# Altium schematic sheet RP_ComputeModule3_rev.3.0.SchDoc
size A4
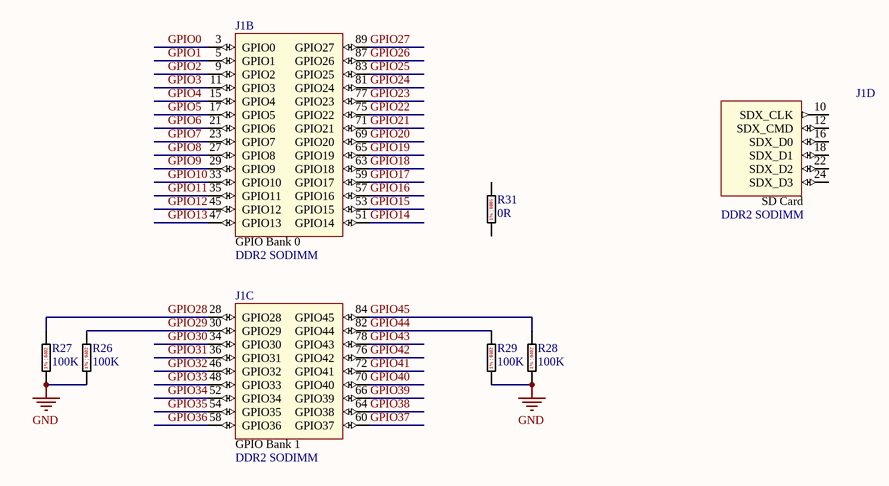
[diagram p0: RP_ComputeModule3_rev.3.0.SchDoc]

## Parts
J1  DDR2 SODIMM  [TE 1473005-4 (DDR2 SO-DIMM)]  (parts B,C,D of 14)
R26  100K  [RES0402]
R27  100K  [RES0402]
R28  100K  [RES0402]
R29  100K  [RES0402]
R31  0R  [YAGEO RES0402]

## Nets
GND: R26.2 R27.2 R28.2 R29.2
GPIO0: J1.3(GPIO0)
GPIO1: J1.5(GPIO1)
GPIO2: J1.9(GPIO2)
GPIO3: J1.11(GPIO3)
GPIO4: J1.15(GPIO4)
GPIO5: J1.17(GPIO5)
GPIO6: J1.21(GPIO6)
GPIO7: J1.23(GPIO7)
GPIO8: J1.27(GPIO8)
GPIO9: J1.29(GPIO9)
GPIO10: J1.33(GPIO10)
GPIO11: J1.35(GPIO11)
GPIO12: J1.45(GPIO12)
GPIO13: J1.47(GPIO13)
GPIO14: J1.51(GPIO14)
GPIO15: J1.53(GPIO15)
GPIO16: J1.57(GPIO16)
GPIO17: J1.59(GPIO17)
GPIO18: J1.63(GPIO18)
GPIO19: J1.65(GPIO19)
GPIO20: J1.69(GPIO20)
GPIO21: J1.71(GPIO21)
GPIO22: J1.75(GPIO22)
GPIO23: J1.77(GPIO23)
GPIO24: J1.81(GPIO24)
GPIO25: J1.83(GPIO25)
GPIO26: J1.87(GPIO26)
GPIO27: J1.89(GPIO27)
GPIO28: J1.28(GPIO28) R27.1
GPIO29: J1.30(GPIO29) R26.1
GPIO30: J1.34(GPIO30)
GPIO31: J1.36(GPIO31)
GPIO32: J1.46(GPIO32)
GPIO33: J1.48(GPIO33)
GPIO34: J1.52(GPIO34)
GPIO35: J1.54(GPIO35)
GPIO36: J1.58(GPIO36)
GPIO37: J1.60(GPIO37)
GPIO38: J1.64(GPIO38)
GPIO39: J1.66(GPIO39)
GPIO40: J1.70(GPIO40)
GPIO41: J1.72(GPIO41)
GPIO42: J1.76(GPIO42)
GPIO43: J1.78(GPIO43)
GPIO44: J1.82(GPIO44) R29.1
GPIO45: J1.84(GPIO45) R28.1

Not connected (* = marked no-connect by the designer): J1 10(SDX_CLK) 12(SDX_CMD) 16(SDX_D0) 18(SDX_D1) 22(SDX_D2) 24(SDX_D3); R31 1 2

## Notes on the sheet
- (in symbol 1473005-4, part B) GPIO Bank 0
- (in symbol 1473005-4, part C) GPIO Bank 1
- (in symbol 1473005-4, part D) SD Card
- (in symbol AC0805FR-070RL) 1% | 0805
- (in symbol SG73P1ETTP1003F) 1% | 0402

## Library data of the parts
J1 = 1473005-4: TE CONNECTIVITY / AMP         1473005-4             SOCKET IC, DIMM, DDR2, 1.8V, 200WAY; Number of Contacts: 200; Memory Type: SDRAM,DDR; Insulation Resistance: 250MR; PCB Mount Retention: With; Gender: Female; Contact Current Rating: 500mA; Circuit Application: Power; Connector System: Cable-to-Board; Sealable: No (Without); Pitch: 0.6mm; Row Spacing: 0.244inch; Stack Height: 5.2mm; Supplier 1: Digi-Key; Manufacturer: TE Connectivity; Manufacturer Part Number: 1473005-4; Stock 1: 3804; Pricing 1: 1=3.9, 10=3.744, 25=3.432, 50=3.276, 100=3.12, 250=2.73, 500=2.652, 1000=2.262, 2500=2.106 (USD); Mount: Surface Mount; Number of Pins: 200; Contact Material: Copper Alloy; Contact Plating: Gold; Housing Colour: Black; Housing Material: Thermoplastic; Insulation Material: Thermoplastic; Min Operating Temperature: -67°C; Max Operating Temperature: 185°C; Number of Rows: 2; Orientation: Right Angle; Termination: Solder; Packaging: Tray; Package Quantity: 20; Number of Positions: 200; Voltage Rating: 1.8V; Connector Type: Socket; Length: 71.5mm; Depth: 26mm; Radiation Hardening: No; ELV: Compliant; Flammability Rating: UL94 V-0; Lead Free: Lead Free; REACH SVHC: No SVHC; ComponentLink1URL: https://datasheet.ciiva.com/682/eng-cd-1473005-j2-682720.pdf; ComponentLink1Description: https://datasheet.ciiva.com/682/eng-cd-1473005-j2-682720.pdf; ComponentLink2URL: https://datasheet.ciiva.com/15171/getdatasheetpartid-99150-15171488.pdf; ComponentLink2Description: https://datasheet.ciiva.com/15171/getdatasheetpartid-99150-15171488.pdf; ComponentLink3URL: https://datasheet.ciiva.com/1105/582309-1105221.pdf; ComponentLink3Description: https://datasheet.ciiva.com/1105/582309-1105221.pdf; ComponentLink4URL: https://datasheet.ciiva.com/682/eng-cd-1473005-j2-682726.pdf; ComponentLink4Description: https://datasheet.ciiva.com/682/eng-cd-1473005-j2-682726.pdf; ComponentLink5URL: https://datasheet.ciiva.com/14156/04821302-14156311.pdf; ComponentLink5Description: https://datasheet.ciiva.com/14156/04821302-14156311.pdf; ComponentLink6URL: https://datasheet.ciiva.com/3136/eng-cd-1473005-j-3136060.pdf; ComponentLink6Description: https://datasheet.ciiva.com/3136/eng-cd-1473005-j-3136060.pdf; ComponentLink7URL: https://datasheet.ciiva.com/16380/eng-cd-1473005-j-16380909.pdf; ComponentLink7Description: https://datasheet.ciiva.com/16380/eng-cd-1473005-j-16380909.pdf; ComponentLink8URL: https://datasheet.ciiva.com/16651/eng-cd-1473005-j-16651646.pdf; ComponentLink8Description: https://datasheet.ciiva.com/16651/eng-cd-1473005-j-16651646.pdf
R26-R29 = SG73P1ETTP1003F: Thick Film Resistors - SMD 0.125W 100Kohm 1% 200ppm; Manufacturer: KOA Speer; Resistance: 100kR; Power Rating: 125mW; Voltage Rating: 200V; Temperature Coefficient: 200ppm/°C; Voltage Rating (DC): 50V; Supplier 1: Mouser; Manufacturer Part Number: SG73P1ETTP1003F; Stock 1: 17094; Pricing 1: 1=0.24, 10=0.24, 50=0.053, 100=0.041, 1000=0.03, 10000=0.018 (USD); Case/Package: 0402; Case Code (Imperial): 0402; Case Code (Metric): 1005; Min Operating Temperature: -55°C; Max Operating Temperature: 155°C; Tolerance: 1%; Packaging: Tape and Reel; Termination: SMD/SMT; ComponentLink1URL: https://datasheet.ciiva.com/5567/sg73-5567782.pdf; ComponentLink1Description: https://datasheet.ciiva.com/5567/sg73-5567782.pdf
R31 = AC0805FR-070RL: Thick Film Resistors - SMD 1/8W 0.0ohm 1%; Manufacturer: Yageo; Voltage Rating: 150V; Power Rating: 125mW; Resistance: 0mR; Temperature Coefficient: 200ppm/°C; Supplier 1: Mouser; Manufacturer Part Number: AC0805FR-070RL; Stock 1: 1027; Pricing 1: 1=0.16, 10=0.036, 50=0.036, 100=0.012, 1000=0.009, 10000=0.004 (USD); Mount: Surface Mount; Case/Package: 0805; Case Code (Imperial): 0805; Case Code (Metric): 2012; Min Operating Temperature: -55°C; Max Operating Temperature: 155°C; Tolerance: 1%; Packaging: Tape and Reel; Termination: SMD/SMT; Lead Free: Lead Free; ComponentLink1URL: https://datasheet.ciiva.com/12656/pyu-ac-51-rohs-l-2-12656890.pdf; ComponentLink1Description: https://datasheet.ciiva.com/12656/pyu-ac-51-rohs-l-2-12656890.pdf